# EAGLE design VGAX board rev 11 PAPER VERSION option 2 mask test (EAGLE 9.3.0)
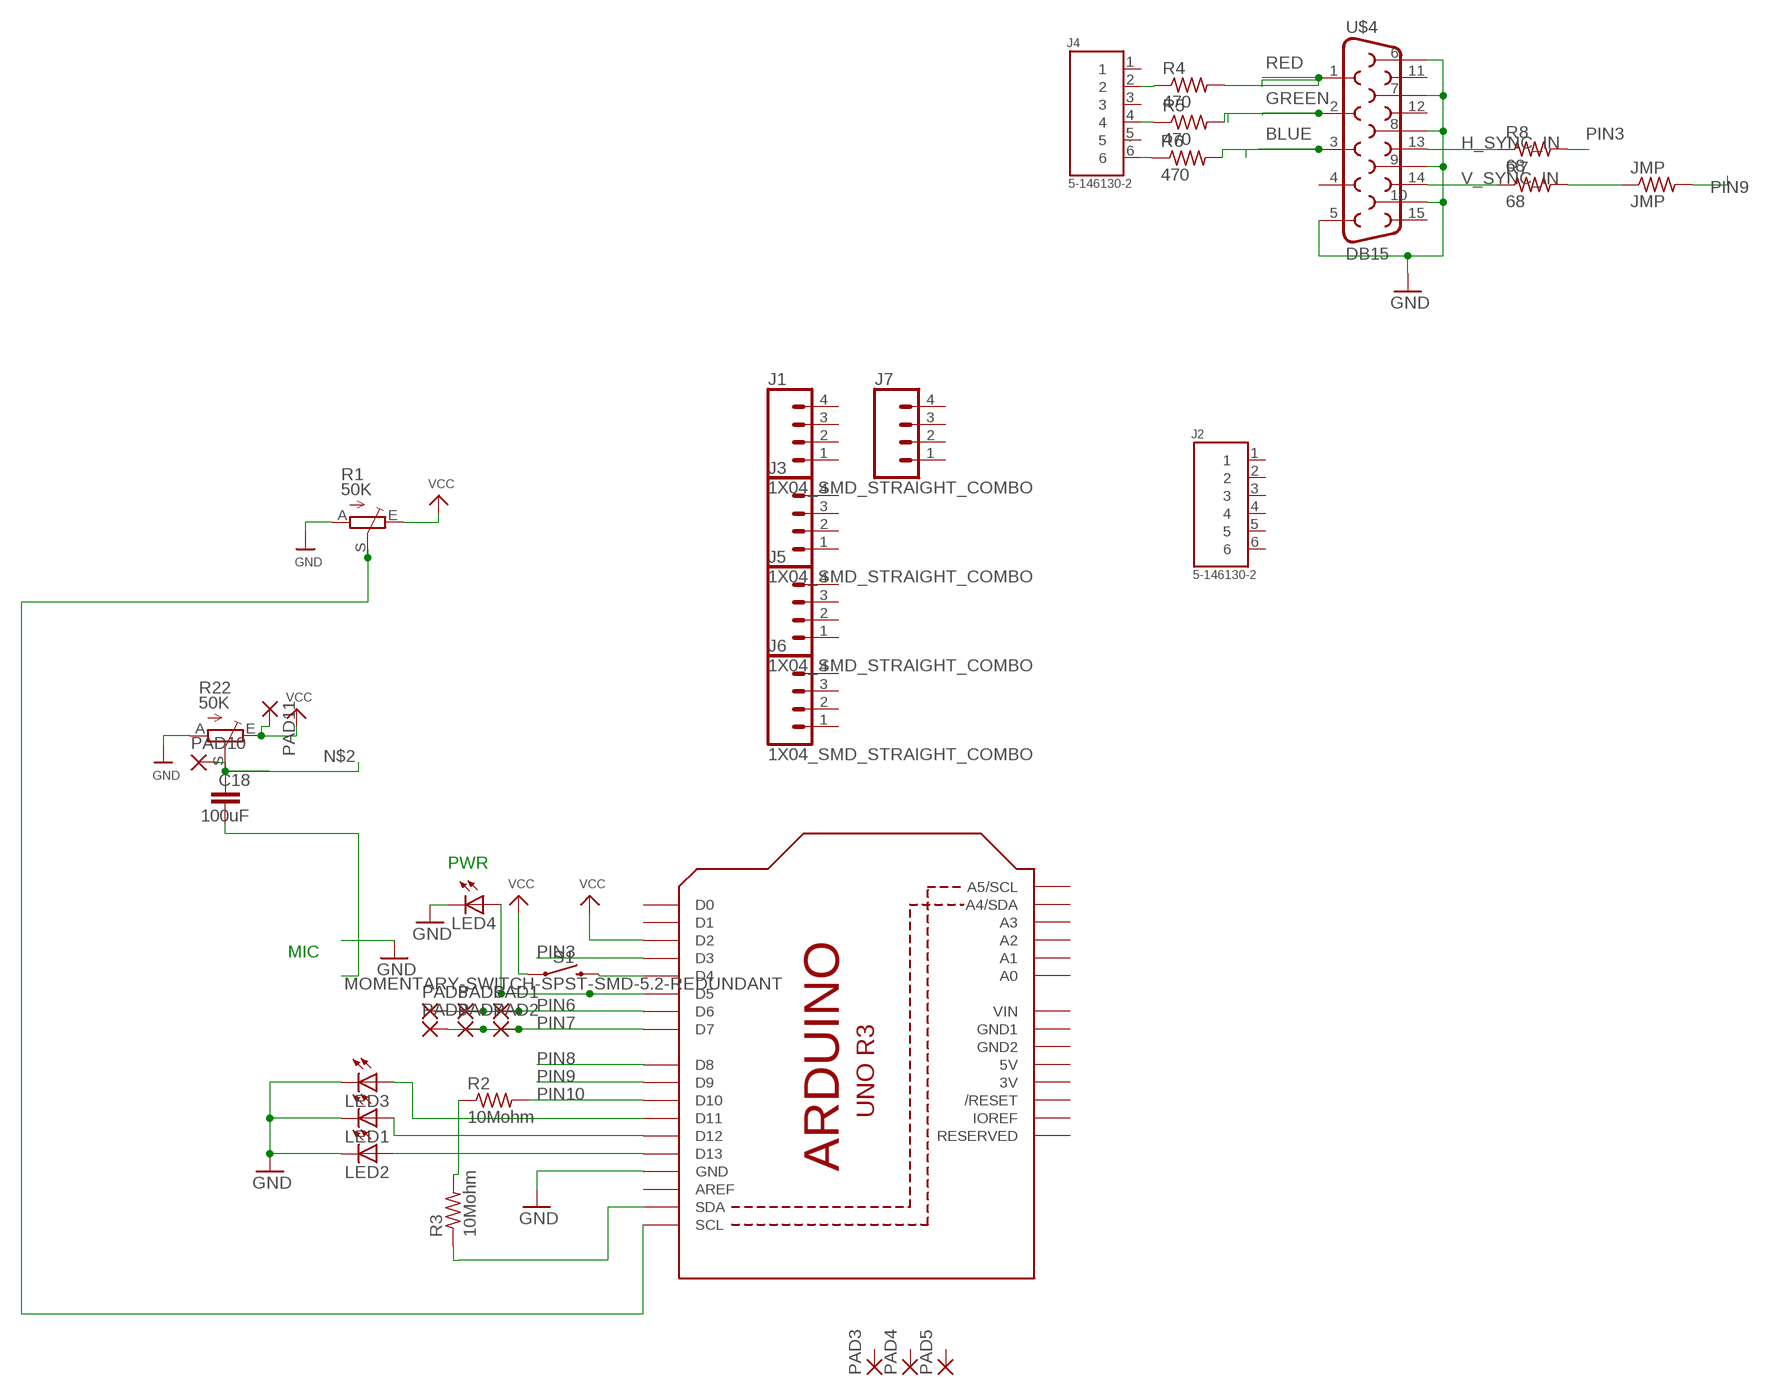
[diagram p0: schematic, sheet 1]

## Parts
C18  100uF  1.0UF-1206-50V-10%  [1206]
J1  1X04_SMD_STRAIGHT_COMBO  CONN_04SMD_STRAIGHT_COMBO  [1X04_SMD_VERTICAL_COMBO]
J2  5-146130-2  [5-146130-2]
J3  1X04_SMD_STRAIGHT_COMBO  CONN_04SMD_STRAIGHT_COMBO  [1X04_SMD_VERTICAL_COMBO]
J4  5-146130-2  [5-146130-2]
J5  1X04_SMD_STRAIGHT_COMBO  CONN_04SMD_STRAIGHT_COMBO  [1X04_SMD_VERTICAL_COMBO]
J6  1X04_SMD_STRAIGHT_COMBO  CONN_04SMD_STRAIGHT_COMBO  [1X04_SMD_VERTICAL_COMBO]
J7  1X04_SMD_STRAIGHT_COMBO  CONN_04SMD_STRAIGHT_COMBO  [1X04_SMD_VERTICAL_COMBO]
JMP  JMP  R-US_M1206  [M1206]
LED1  LEDCHIPLED_1206  [CHIPLED_1206]
LED2  LEDCHIPLED_1206  [CHIPLED_1206]
LED3  LEDCHIPLED_1206  [CHIPLED_1206]
LED4  LEDCHIPLED_1206  [CHIPLED_1206]
PAD1  SMD2  [SMD1,27-2,54]
PAD2  SMD2  [SMD1,27-2,54]
PAD3  SMD2  [SMD1,27-2,54]
PAD4  SMD2  [SMD1,27-2,54]
PAD5  SMD2  [SMD1,27-2,54]
PAD6  SMD2  [SMD1,27-2,54]
PAD7  SMD2  [SMD1,27-2,54]
PAD8  SMD2  [SMD1,27-2,54]
PAD9  SMD2  [SMD1,27-2,54]
PAD10  SMD2  [SMD1,27-2,54]
PAD11  SMD2  [SMD1,27-2,54]
R1  50K  TRIM_EU-CA9V  [CA9V]
R2  10Mohm  R-US_M1206  [M1206]
R3  10Mohm  R-US_M1206  [M1206]
R4  470  R-US_M1206  [M1206]
R5  470  R-US_M1206  [M1206]
R6  470  R-US_M1206  [M1206]
R7  68  R-US_M1206  [M1206]
R8  68  R-US_M1206  [M1206]
R22  50K  TRIM_EU-CA9V  [CA9V]
S1  MOMENTARY-SWITCH-SPST-SMD-5.2-REDUNDANT  [TACTILE_SWITCH_SMD_5.2MM]
U1  ARDUINOR3-BPLACE  [ARDUINOR3-BPLACE]
U$4  DB15  [DB15]

## Nets
BLUE: R6.2 U$4.3
GND: LED1.C LED2.C LED3.C LED4.C R1.A R22.A U1.GND U$4.5 U$4.6 U$4.7 U$4.8 U$4.9 U$4.10
GREEN: R5.2 U$4.2
H_SYNC_IN: R8.1 U$4.13
N$1: JMP.1 R7.2
N$2: C18.1 PAD10.1(P) R22.S
N$4: R1.S U1.SCL
N$5: R2.1 R3.2
N$6: LED2.A U1.D13
N$7: LED1.A U1.D12
N$8: LED3.A U1.D11
N$11: C18.2
N$12: LED4.A U1.D5
N$13: S1.3 S1.4 U1.D4
N$15: J4.6 R6.1
N$16: J4.4 R5.1
N$17: J4.2 R4.1
PIN3: R8.2 U1.D3
PIN6: PAD1.1(P) PAD6.1(P) PAD8.1(P) U1.D6
PIN7: PAD2.1(P) PAD7.1(P) PAD9.1(P) U1.D7
PIN8: R3.1 U1.D8 U1.SDA
PIN9: JMP.2 U1.D9
PIN10: R2.2 U1.D10
RED: R4.2 U$4.1
V_SYNC_IN: R7.1 U$4.14
VCC: PAD11.1(P) R1.E R22.E S1.1 S1.2 U1.D2
Unconnected: J1.1 J1.2 J1.3 J1.4 J2.1 J2.2 J2.3 J2.4 J2.5 J2.6 J3.1 J3.2 J3.3 J3.4 J4.1 J4.3 J4.5 J5.1 J5.2 J5.3 J5.4 J6.1 J6.2 J6.3 J6.4 J7.1 J7.2 J7.3 J7.4 PAD3.1(P) PAD4.1(P) PAD5.1(P) U1.A0 U1.A1 U1.A2 U1.A3 U1.A4(A4/SDA) U1.A5(A5/SCL) U1.AREF U1.D0 U1.D1 U1.IOREF U1.RESERVED U1.RESET(/RESET) U$4.4 U$4.11 U$4.12 U$4.15

## Notes on the sheet
- PWR
- MIC

## Power pins joined to a net without a drawn wire
3V: U1.3V
5V: U1.5V
GND1: U1.GND1
GND2: U1.GND2
VIN: U1.VIN

## Library data of the parts
C18 = SparkFun-Capacitors:1.0UF: 1µF ceramic capacitors A capacitor is a passive two-terminal electrical component used to store electrical energy temporarily in an electric field.; PROD_ID: CAP-09822; VALUE: 1.0uF
J1 J3 J5-J7 = SparkFun-Connectors:CONN_04: Multi connection point. Often used as Generic Header-pin footprint for 0.1 inch spaced/style header connections On any of the 0.1 inch spaced packages, you can populate with these: Break Away Headers - Straight <https://www.sparkfun.com/products/116> (PRT-00116) Break Away Male Headers - Right Angle <https://www.sparkfun.com/products/553> (PRT-00553) Female Headers <https://www.sparkfun.com/products/115> (PRT-00115) Break Away Headers - Machine Pin <https://www.sparkfun.com/products/117> (PRT-00117) Break Away Female Headers - Swiss Machine Pin <https://www.sparkfun.com/products/743> (PRT-00743) For SCREWTERMINALS and SPRING TERMINALS visit here: Screw Terimnals on SparkFun.com <https://www.sparkfun.com/search/results?term=Screw+Terminals> (5mm/3.5mm/2.54mm spacing) This device is also useful as a general connection point to wire up your design to another part of your project. Our various solder wires solder well into these plated through hole pads. Hook-Up Wire - Assortment (Stranded, 22 AWG) <https://www.sparkfun.com/products/11375> (PRT-11375) Hook-Up Wire - Assortment (Solid Core, 22 AWG) <https://www.sparkfun.com/products/11367> (PRT-11367) View the entire wire category on our website here <https://www.sparkfun.com/categories/141> Special notes: Molex polarized connector foot print use with SKU : PRT-08231 with associated crimp pins and housings. 1MM SMD Version SKU: PRT-10208; PROD_ID: CONN-08511
J2 J4 = Connectors:5-146130-2: CONN HEADER SMD 6POS 2.54MM Manufacturer's datasheet <https://www.te.com/commerce/DocumentDelivery/DDEController?Action=srchrtrv&DocNm=146130&DocType=Customer+Drawing&DocLang=English>; CREATED_BY: PCBLayout.com; DIGIKEY_PART_NUMBER: 5-146130-2-ND; MANUFACTURER: TE Connectivity AMP Connectors; MPN: 5-146130-2
JMP R2-R8 = adafruit:R-US_: RESISTOR, American symbol
LED1-LED4 = adafruit:LED: LED OSRAM: - CHIPLED LG R971, LG N971, LY N971, LG Q971, LY Q971, LO R971, LY R971 LH N974, LH R974 LS Q976, LO Q976, LY Q976 LO Q996 - Hyper CHIPLED LW Q18S LB Q993, LB Q99A, LB R99A - SideLED LS A670, LO A670, LY A670, LG A670, LP A670 LB A673, LV A673, LT A673, LW A673 LH A674 LY A675 LS A676, LA A676, LO A676, LY A676, LW A676 LS A679, LY A679, LG A679 - Hyper Micro SIDELED® LS Y876, LA Y876, LO Y876, LY Y876 LT Y87S - SmartLED LW L88C, LW L88S LB L89C, LB L89S, LG L890 LS L89K, LO L89K, LY L89K LS L896, LA L896, LO L896, LY L896 - TOPLED LS T670, LO T670, LY T670, LG T670, LP T670 LSG T670, LSP T670, LSY T670, LOP T670, LYG T670 LG T671, LOG T671, LSG T671 LB T673, LV T673, LT T673, LW T673 LH T674 LS T676, LA T676, LO T676, LY T676, LB T676, LH T676, LSB T676, LW T676 LB T67C, LV T67C, LT T67C, LS T67K, LO T67K, LY T67K, LW E67C LS E67B, LA E67B, LO E67B, LY E67B, LB E67C, LV E67C, LT E67C LW T67C LS T679, LY T679, LG T679 LS T770, LO T770, LY T770, LG T770, LP T770 LB T773, LV T773, LT T773, LW T773 LH T774 LS E675, LA E675, LY E675, LS T675 LS T776, LA T776, LO T776, LY T776, LB T776 LHGB T686 LT T68C, LB T68C - Hyper Mini TOPLED® LB M676 - Mini TOPLED Santana® LG M470 LS M47K, LO M47K, LY M47K Source: http://www.osram.convergy.de/
PAD1-PAD11 = wirepad:SMD2: SMD PAD
R1 R22 = pot:TRIM_EU-: POTENTIOMETER
S1 = SparkFun-Switches:MOMENTARY-SWITCH-SPST: Momentary Switch (Pushbutton) - SPST Normally-open (NO) SPST momentary switches (buttons, pushbuttons). Variants PTH-12MM - 12mm square, through-hole Momentary Pushbutton Switch - 12mm Square <https://www.sparkfun.com/products/9190> (COM-09190) PTH-6.0MM, PTH-6.0MM-KIT - 6.0mm square, through-hole Mini Pushbutton Switch <https://www.sparkfun.com/products/97> (COM-00097) KIT package intended for soldering kit's - only one side of pads' copper is exposed. PTH-RIGHT-ANGLE-KIT - Right-angle, through-hole Right Angle Tactile Button <https://www.sparkfun.com/products/10791> - Used on SparkFun BigTime Watch Kit <https://www.sparkfun.com/products/11734> SMD-12MM - 12mm square, surface-mount Tactile Button - SMD (12mm) <https://www.sparkfun.com/products/12993> (COM-12993) Used on SparkFun PicoBoard <https://www.sparkfun.com/products/11888> SMD-4.5MM - 4.5mm Square Trackball Switch Used on SparkFun Blackberry Trackballer Breakout <https://www.sparkfun.com/products/13169> SMD-4.6MMX2.8MM - 4.60mm x 2.80mm, surface mount Used on SparkFun SAMD21 Mini Breakout <https://www.sparkfun.com/products/13664> SMD-5.2MM, SMD-5.2-REDUNDANT - 5.2mm square, surface-mount Mini Pushbutton Switch - SMD <https://www.sparkfun.com/products/8720> (COM-08720) Used on Arduino Pro Mini <https://www.sparkfun.com/products/11114> REDUNDANT package connects both switch circuits together SMD-6.0X3.5MM - 6.0 x 3.5mm, surface mount Momentary Reset Switch SMD <https://www.sparkfun.com/products/8229> (COM-08229) SMD-6.2MM-TALL - 6.2mm square, surface mount Tactile Button - SMD (6mm) <https://www.sparkfun.com/products/12992> Used on SparkFun Digital Sandbox <https://www.sparkfun.com/products/12651> SMD-RIGHT-ANGLE - Right-angle, surface mount Used on SparkFun Block for Intel® Edison - Arduino <https://www.sparkfun.com/products/13036>; PROD_ID: SWCH-08247; SF_SKU: COM-08720
U1 = adafruit:ARDUINOR3: This is a new object for the new Arduino R3 - with extra pins that you may want to use (such as IOref, and duplicated A4/A5
U$4 = SparkFun-Retired:DB15: DB15 / VGA right angle through-hole female connector.

## Board
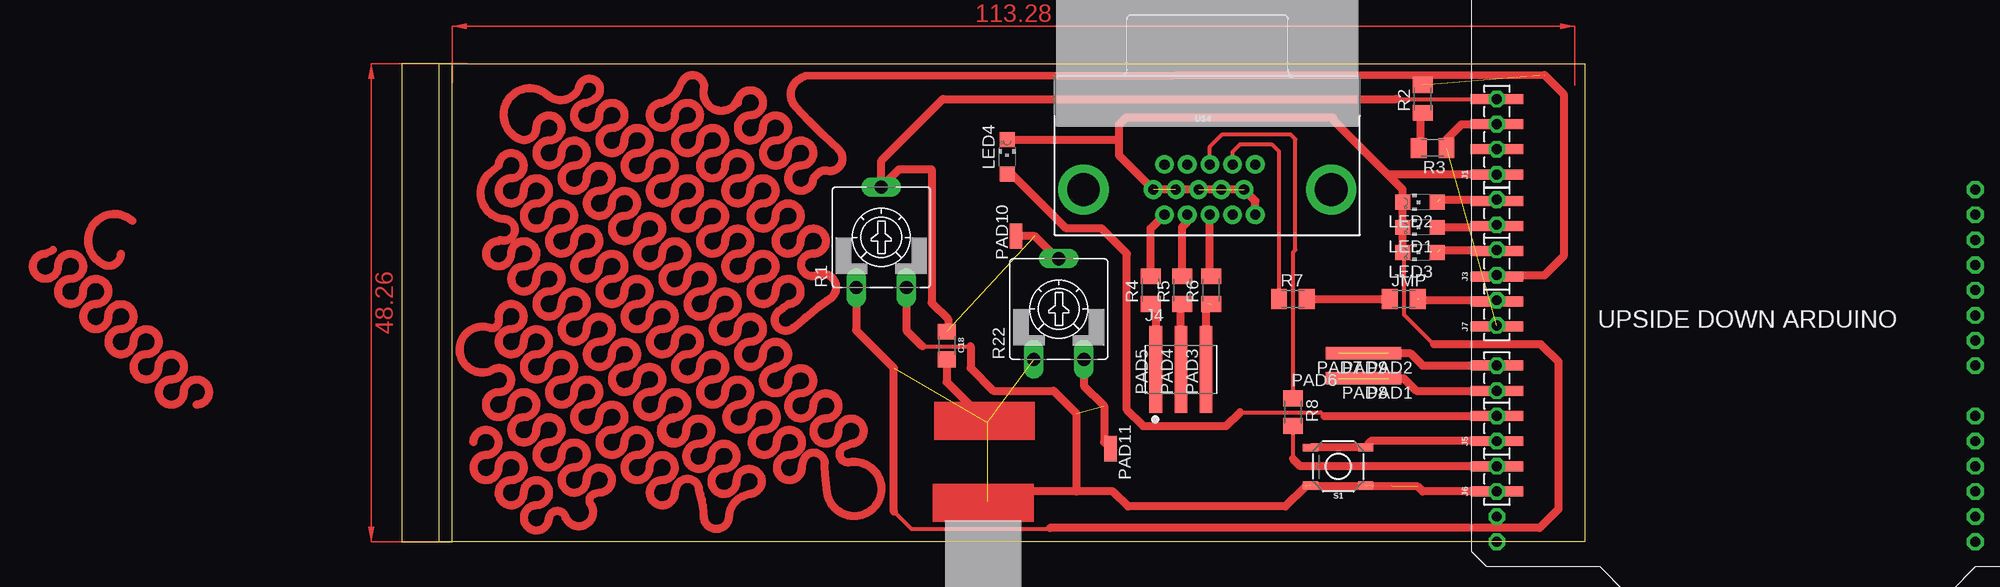
[diagram p1: board, top side]
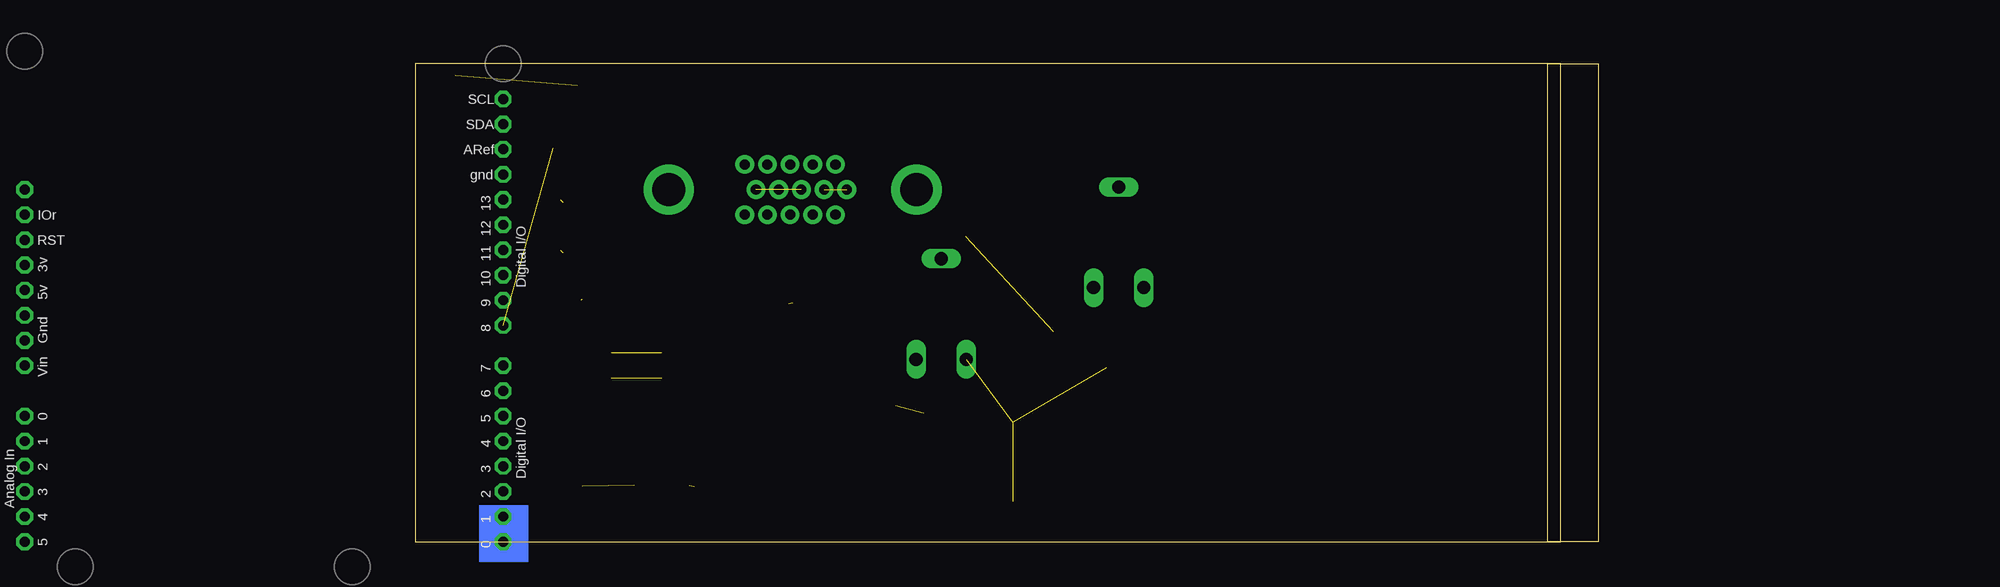
[diagram p2: board, bottom side, seen from below]

Size 115.57 x 48.26 mm. Coordinates in mm from the lower left corner, seen from the top.
Outline: 115.57,48.26 115.57,0 0,0 0,48.26 115.57,48.26
Copper layers (1*16): Top 0.035mm / dielectric 1.5mm / Bottom 0.035mm
Design rules "default *": minimum track width 32mil, minimum drill 0.35mm, track to track 6mil, track to pad 6mil, pad to pad 6mil, via to via 6mil, smd to smd 6mil, copper to edge 40mil, drill to drill 6mil, minimum pad ring 10mil, minimum via ring 8mil, stop-mask expansion 4mil, vias tented up to drill 0mil, thermal gap 10mil
Milling: area -3.8,0 to 1.3,48.3

### Footprints (pad centres in the part's own frame; a part is rotated, then mirrored left to right if it is on the bottom)
1206 = smd 1.6 x 1.8: 1 -1.4,0; 2 1.4,0
1X04_SMD_VERTICAL_COMBO = smd 1 x 2: 1 0,-1.65; 1-2 0,1.65; 2 2.54,1.65; 2-2 2.54,-1.65; 3 5.08,-1.65; 3-2 5.08,1.65; 4 7.62,1.65; 4-2 7.62,-1.65
5-146130-2 = smd 1.27 x 3.56: 1 -2.54,-2.605; 2 -2.54,2.605; 3 0,-2.605; 4 0,2.605; 5 2.54,-2.605; 6 2.54,2.605
M1206 = smd 1.6 x 2: 1 -1.4,0; 2 1.4,0
CHIPLED_1206 = smd 1.5 x 1.5: A 0,-1.75; C 0,1.75
SMD1,27-2,54 = smd 1.27 x 2.54: 1 0,0
CA9V = drill 1.321 long: A -2.54,-5.08; E 2.54,-5.08; S 0,5.08
TACTILE_SWITCH_SMD_5.2MM = smd 1.524 x 0.762: 1 -2.794,1.905; 2 2.794,1.905; 3 -2.794,-1.905; 4 2.794,-1.905
ARDUINOR3-BPLACE = drill 1 pad 1.676 octagon: 3V 35.56,2.54; 5V 38.1,2.54; A0 50.8,2.54; A1 53.34,2.54; A2 55.88,2.54; A3 58.42,2.54; A4 60.96,2.54; A5 63.5,2.54; AREF 23.876,50.8; D0 63.5,50.8; D1 60.96,50.8; D2 58.42,50.8; D3 55.88,50.8; D4 53.34,50.8; D5 50.8,50.8; D6 48.26,50.8; D7 45.72,50.8; D8 41.656,50.8; D9 39.116,50.8; D10 36.576,50.8; D11 34.036,50.8; D12 31.496,50.8; D13 28.956,50.8; GND 26.416,50.8; GND1 43.18,2.54; GND2 40.64,2.54; IOREF 30.48,2.54; RESERVED 27.94,2.54; RESET 33.02,2.54; SCL 18.796,50.8; SDA 21.336,50.8; VIN 45.72,2.54
DB15 = drill 1.016 pad 1.88: 1 -4.32,-7.62; 2 -2.03,-7.62; 3 0.26,-7.62; 4 2.55,-7.62; 5 4.84,-7.62; 6 -5.46,-5.08; 7 -3.17,-5.08; 8 -0.88,-5.08; 9 1.41,-5.08; 10 3.7,-5.08; 11 -4.32,-2.54; 12 -2.03,-2.54; 13 0.26,-2.54; 14 2.55,-2.54; 15 4.84,-2.54 | drill 3.302 pad 5.08: G1 -12.5,-5.08; G2 12.5,-5.08

### Placement (x,y rotation side)
C18  51.18,19.81 270 top
J1  106.68,37.08 90 top
J2  91.06,-17.78 90 top  (outside the outline)
J3  106.68,26.8 90 top
J4  74.8,17.4 0 top
J5  106.68,10.16 90 top
J6  106.68,5.08 90 top
J7  106.68,21.72 90 top
JMP  97.28,24.51 0 top
LED1  98.93,31.75 90 top
LED2  98.93,34.29 90 top
LED3  98.93,29.21 90 top
LED4  57.28,38.86 0 top
PAD1  95.76,16.51 90 top
PAD2  95.76,19.05 90 top
PAD3  77.34,17.27 0 top
PAD4  74.8,17.27 0 top
PAD5  72.26,17.27 0 top
PAD6  90.68,16.51 90 top
PAD7  90.68,19.05 90 top
PAD8  93.22,16.51 90 top
PAD9  93.22,19.05 90 top
PAD10  58.17,30.86 0 top
PAD11  67.69,9.4 180 top
R1  44.58,30.73 0 top
R2  99.19,44.7 90 top
R3  100.2,39.75 180 top
R4  71.75,25.4 90 top
R5  74.93,25.4 90 top
R6  77.85,25.4 90 top
R7  86.11,24.51 0 top
R8  86.11,13.08 270 top
R22  62.48,23.5 0 top
S1  90.68,7.62 180 top
U1  157.48,63.5 270 bottom
U$4  77.47,40.64 0 top

### Tracks (layer width: path | path; a pad name or v marks a point on that pad's centre or on a via)
BLUE
  Top 0.813: R6.2 77.73,26.92 U$4.3
GND  (5 unrouted)
  Top 0.406: LED3.C 97.31,29.08 97.31,22.96 100.33,19.94 | 61.59,1.4 61.47,1.27 47.62,1.27 45.85,3.05
  Top 0.813: U1.GND 95.66,37.08 | 69.09,42.67 69.22,42.8 90.2,42.8 90.2,42.55 95.66,37.08 | 69.09,42.67 68.58,42.16 68.58,40.64 | 69.09,42.67 69.22,42.67 | LED3.C LED1.C LED2.C 97.18,35.56 95.66,37.08 | 100.33,19.94 111.12,19.94 112.9,18.16 112.9,3.3 111,1.4 61.59,1.4 | 55.24,12.07 55.24,11.68 | U$4.5 82.31,34.42 U$4.10 U$4.6 68.58,38.99 68.58,40.64 | R1.A 42.04,21.34 45.85,17.53 45.85,3.05 | LED4.C 68.55,40.61 68.58,40.64
GREEN
  Top 0.813: R5.2 74.93,31.75 75.44,32.26 U$4.2
H_SYNC_IN
  Top 0.406: U$4.13 77.73,39.88 79,41.15 85.85,41.15 86.36,40.64 86.36,29.46 86.11,29.21 R8.1
N$1
  Top 0.813: R7.2 JMP.1
N$2  (1 unrouted)
  Top 0.813: R22.S 62.36,28.57 62.17,28.77 60.07,30.86 PAD10.1
N$3
  Top 0.813: 30.1,44.32 arc-270 31.37,43.05 arc270 32.64,41.78 arc-270 33.91,40.51 arc270 35.18,39.24 arc-270 36.45,37.97 arc270 37.72,36.7 38.23,37.21 arc-58 39.12,37.47 arc150 40.26,39.62 arc-5 35.93,43.95 arc-110 36.58,46.86
N$4
  Top 0.406: 96.52,44.7 U1.SCL
  Top 0.813: U1.SCL 106.43,44.45 | 96.52,44.7 50.8,44.7 44.58,38.48 R1.S 46.36,37.59 49.66,37.59 49.66,24.13 51.31,22.48 51.31,21.21
N$5
  Top 0.813: R2.1 98.93,43.05 98.93,39.88 R3.2
N$6  (1 unrouted)
  Top 0.813: 100.94,34.54 U1.D13
N$7
  Top 0.406: 106.43,31.75 U1.D12
  Top 0.813: LED1.A 106.43,31.75
N$8  (1 unrouted)
  Top 0.813: 100.94,29.46 U1.D11
N$11  (1 unrouted)
  Top 0.813: 51.16,18.39 C18.2 51.18,16.13 55.24,12.07 | 54.71,3.53 54.8,3.62 55.24,4.06
N$12
  Top 0.406: 80.77,13.08 88.9,13.08 89.28,12.7
  Top 0.813: LED4.A 57.76,37.11 60.58,34.29 60.77,34.1 63.25,31.62 66.8,31.62 69.34,29.08 69.34,13.34 70.99,11.68 79.37,11.68 80.77,13.08 | 89.28,12.7 U1.D5
N$13
  Top 0.406: S1.3 93.34,9.52
  Top 0.813: U1.D4 93.98,10.16 93.34,9.52 | S1.3 S1.4
N$15  (1 unrouted)
  Top 0.813: J4.6 77.34,24 77.47,24.13
N$16
  Top 0.813: J4.4 74.8,23.87 R5.1
N$17
  Top 0.406: 72.26,23.49 J4.2
  Top 0.813: R4.1 72.26,23.49 72.26,18.92
PIN3
  Top 0.406: R8.2 86.11,8.38
  Top 0.813: U1.D3 86.87,7.62 86.11,8.38
PIN4
  Top 0.813: 37.72,29.08 arc270 36.45,30.35 arc-270 35.18,31.62 arc270 33.91,32.89 arc-270 32.64,34.16 arc270 31.37,35.43 arc-270 30.1,36.7 arc270 28.83,37.97 arc-270 27.56,39.24 arc270 26.29,40.51 arc-270 25.02,41.78 arc270 23.75,43.05 arc-270 22.48,44.32 22.99,44.58 arc37 24.13,45.72 24.51,46.48 arc-166 26.67,45.72 arc168 30.1,44.58
PIN6  (2 unrouted)
  Top 0.813: U1.D6 98.55,15.24 97.28,16.51 PAD1.1
PIN7  (2 unrouted)
  Top 0.813: PAD2.1 97.92,19.05 99.19,17.78 U1.D7
PIN8  (1 unrouted)
  Top 0.813: R3.1 101.6,40.64 103.12,42.16 U1.SDA
PIN9  (1 unrouted)
  Top 0.813: 98.81,24.38 U1.D9
PIN10  (1 unrouted)
  Top 0.813: U1.D10 111.51,26.92 113.41,28.83 113.41,45.21 111.51,47.12 36.83,46.99
PIN12
  Top 0.813: 30.1,13.84 arc270 28.83,15.11 arc-270 27.56,16.38 arc270 26.29,17.65 arc-270 25.02,18.92 arc270 23.75,20.19 arc-270 22.48,21.46 arc270 21.21,22.73 arc-270 19.94,24 arc270 18.67,25.27 arc-270 17.4,26.54 arc270 16.13,27.81 arc-270 14.86,29.08 arc270 13.59,30.35 arc-270 12.32,31.62 arc270 11.05,32.89 arc-270 9.78,34.16 arc270 8.51,35.43 arc-270 7.24,36.7 arc270 5.97,37.97 5.08,37.23 arc136 6.58,32.59 arc-198 6.1,30.48
PIN13
  Top 0.813: 5.97,30.35 arc270 7.24,29.08 arc-270 8.51,27.81 arc270 9.78,26.54 arc-270 11.05,25.27 arc270 12.32,24 arc-270 13.59,22.73 arc270 14.86,21.46 arc-270 16.13,20.19 arc270 17.4,18.92 arc-270 18.67,17.65 arc270 19.94,16.38 arc-270 21.21,15.11 arc270 22.48,13.84 arc-270 23.75,12.57 arc180 23.75,10.03
PIN14
  Top 0.813: 37.85,29.08 arc216 38.1,26.92 arc-164 39.56,24.65 arc7 35.69,21.59 arc-188 34.31,23.35 | 34.31,23.35 | 34.31,23.35 34.67,23.62 35.18,24 arc270 33.91,25.27 arc-270 32.64,26.54 arc270 31.37,27.81 arc-270 30.1,29.08 arc270 28.83,30.35 arc-270 27.56,31.62 arc270 26.29,32.89 arc-270 25.02,34.16 arc270 23.75,35.43 arc-270 22.48,36.7 arc270 21.21,37.97 arc-270 19.94,39.24 arc270 18.67,40.51 arc-270 17.4,41.78 arc270 16.13,43.05 arc-270 14.86,44.32 15.62,44.7 arc227 14.1,45.97 arc-116 10.92,45.09 arc185 7.49,41.02 7.87,40.77 arc124 9.78,41.78
PIN15
  Top 0.813: 9.78,41.78 arc-270 11.05,40.51 arc270 12.32,39.24 arc-270 13.59,37.97 arc270 14.86,36.7 arc-270 16.13,35.43 arc270 17.4,34.16 arc-270 18.67,32.89 arc270 19.94,31.62 arc-270 21.21,30.35 arc270 22.48,29.08 arc-270 23.75,27.81 arc270 25.02,26.54 arc-270 26.29,25.27 arc270 27.56,24 arc-270 28.83,22.73 arc270 30.1,21.46 arc-270 31.37,20.19 arc270 32.64,18.92 arc-270 33.91,17.65
PIN16
  Top 0.813: 3.43,10.03 arc-270 4.7,8.76 arc270 5.97,7.49 arc-270 7.24,6.22 arc270 8.51,4.95 arc-270 9.78,3.68 arc270 11.05,2.41
PIN18
  Top 0.813: 5.21,17.27 arc-221 5.08,21.59 arc109 5.97,22.23 5.97,22.73 arc-270 7.24,21.46 arc270 8.51,20.19 arc-270 9.78,18.92 arc270 11.05,17.65 arc-270 12.32,16.38 arc270 13.59,15.11 arc-270 14.86,13.84 arc270 16.13,12.57 arc-270 17.4,11.3 arc270 18.67,10.03 arc-270 19.94,8.76 arc270 21.21,7.49 arc-270 22.48,6.22 arc270 23.75,4.95 23.88,5.46 arc-152 26.16,5.46
PIN19
  Top 0.813: 5.46,17.4 arc-208 6.03,15.11 5.97,15.11 arc270 7.24,13.84 arc-270 8.51,12.57 arc270 9.78,11.3 arc-270 11.05,10.03 arc270 12.32,8.76 arc-270 13.59,7.49 arc270 14.86,6.22 arc-270 16.13,4.95 15.62,4.83 arc111 15.24,3.81 arc-197 12.7,2.54 arc161 11.05,2.29
PIN20
  Top 0.813: -24.51,13.84 arc270 -25.78,15.11 arc-270 -27.05,16.38 arc270 -28.32,17.65 arc-270 -29.59,18.92 arc270 -30.86,20.19 arc-270 -32.13,21.46 arc270 -33.4,22.73 arc-270 -34.67,24 arc270 -35.94,25.27 arc-270 -37.21,26.54 arc270 -38.48,27.81 arc-270 -39.75,29.08 -38.99,29.46 | -30.99,32.38 arc185 -34.42,28.32 -34.04,28.07 arc124 -32.13,29.08
PIN25
  Top 0.813: 24.38,12.83 23.62,12.45 arc270 24.89,11.18 arc-270 26.16,9.91 arc270 27.43,8.64 arc-270 28.7,7.37 arc270 29.97,6.1 arc-270 31.24,4.83 30.61,4.57 arc67 29.21,2.54 arc-178 26.67,2.54 arc19 26.16,5.33
PIN26
  Top 0.813: 30.99,14.22 30.23,13.84 arc270 31.5,12.57 arc-270 32.77,11.3 arc270 34.04,10.03 arc-270 35.31,8.76 arc270 36.58,7.49 36.7,8.13 arc-171 38.86,7.87
PIN27
  Top 0.813: 34.67,17.91 33.91,17.53 arc270 35.18,16.26 arc-270 36.45,14.99 arc270 37.72,13.72 arc-270 38.99,12.45 arc270 40.26,11.18 arc-270 41.53,9.91 40.89,9.65 arc168 41.36,8.03 arc-272 39.12,4.95 arc-5 38.86,7.62
RED
  Top 0.813: R4.2 71.75,31.62 U$4.1
V_SYNC_IN
  Top 0.406: U$4.14 80.02,39.37 80.78,40.13 83.95,40.13 84.71,39.37 84.71,37.08 84.71,37.09 R7.1
VCC  (3 unrouted)
  Top 0.406: 48.73,19.73 53.59,19.73
  Top 0.813: U1.D2 99.19,5.08 98.68,5.59 87.38,5.59 85.34,3.56 69.47,3.56 67.94,5.08 57.15,5.08 | 48.73,19.73 47.12,21.34 R1.E | 53.59,19.73 53.59,17.53 55.88,15.24 61.98,15.24 64.26,12.95 64.26,5.08 57.15,5.08 | R22.E 65.02,15.75 67.06,13.72 67.06,10.03 PAD11.1 | 67.9,5.08 57.15,5.08 | 55.24,3.17 55.69,3.62 57.15,5.08
(copper drawn outside any net)
  shapes: Bottom area x1, Top area x4

### Text on the board
tPlace: UPSIDE DOWN ARDUINO
Beschreib: VARIABLE | PWR | PRG | SPAGHETTINI | BRIGHT | PRG | SEL | AUDIO IN
Patch_BOT: VARIABLE | SPAGHETTINI
routoute: SPAGHETTINI